# Altium schematic sheet PTFV_GECKO_SNSR.SchDoc: PTFV_GECKO_SNSR
size A4; DrawnBy: Devang Boradhara; Revision: 1; SheetNumber: 5; SheetTotal: 5  of  5
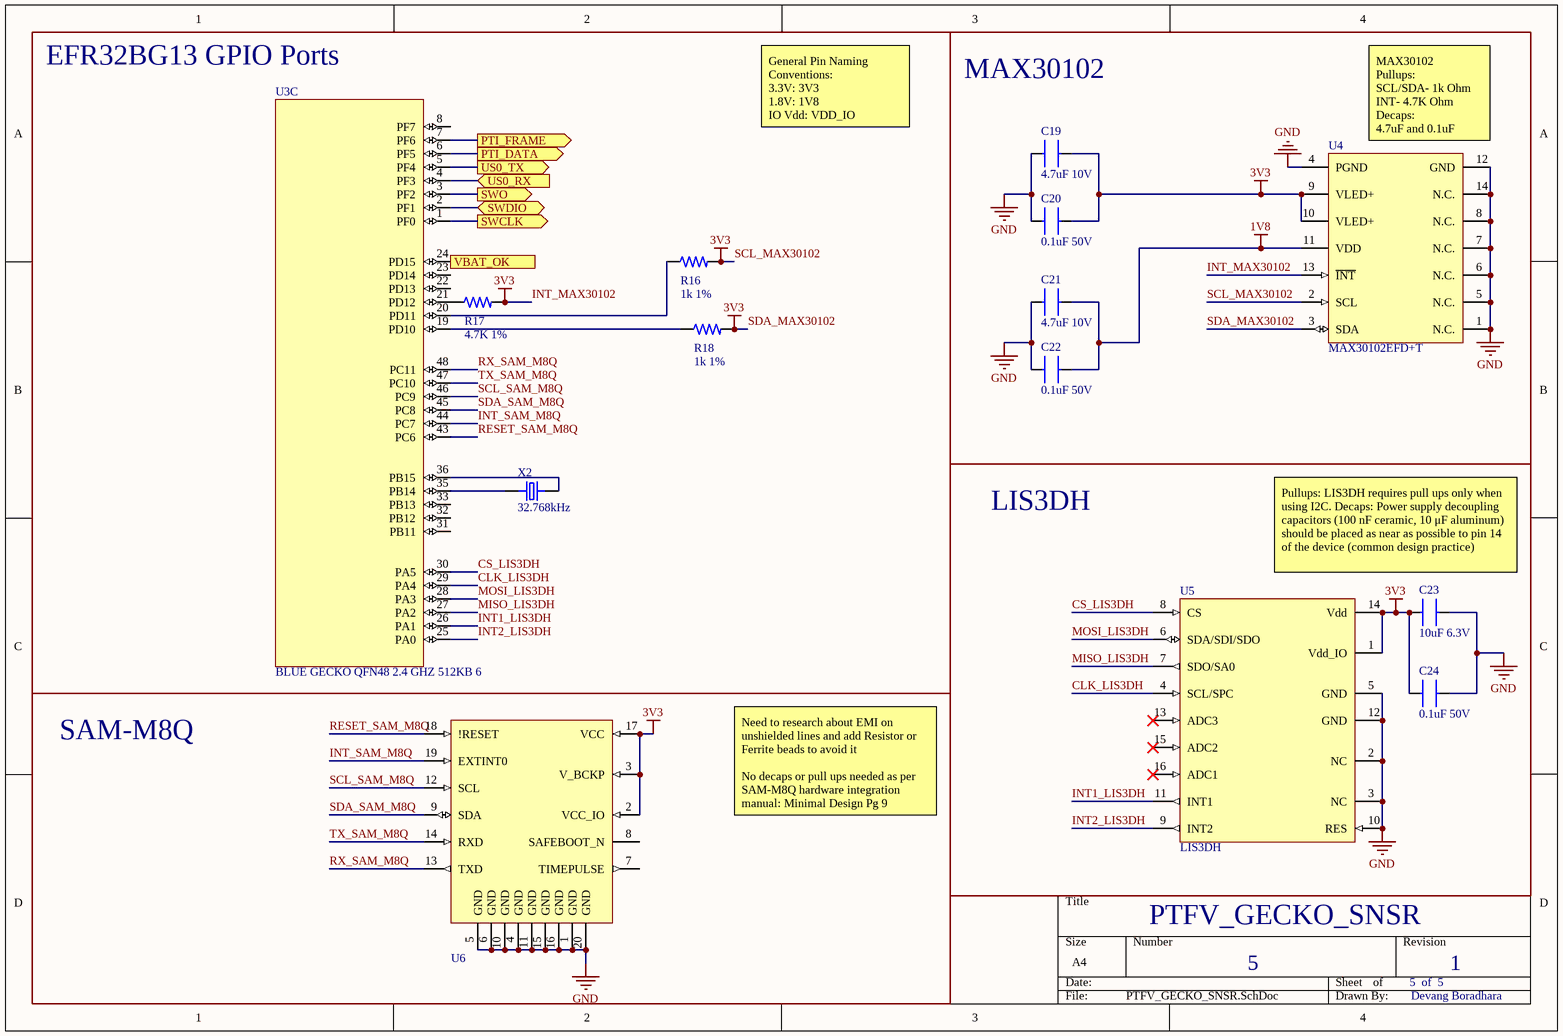
[diagram p0: PTFV_GECKO_SNSR.SchDoc]

## Parts
C19  4.7uF 10V  [CAP_0603_1MM]
C20  0.1uF 50V  [CAP_0603_1MM]
C21  4.7uF 10V  [CAP_0603_1MM]
C22  0.1uF 50V  [CAP_0603_1MM]
C23  10uF 6.3V  [CAP_0603_1MM]
C24  0.1uF 50V  [CAP_0603_1MM]
R16  1k 1%  [RES_0603_1608X06]
R17  4.7K 1%  [RES_0603_1608X06]
R18  1k 1%  [RES_0603_1608X06]
U3  BLUE GECKO QFN48 2.4 GHZ 512KB 6  [QFN_48_7X7]  (part C of 3)
U4  MAX30102EFD+T  [14_SON_SPO2]
U5  LIS3DH  [16_QFN_LIS3DH]
U6  GPS_SAM-M8Q  [20_QFN_SAM_M8Q]  (value not drawn)
X2  32.768kHz  [XTAL_ECS-.327-7-34B-TR]

## Blocks framed on the sheet
EFR32BG13 GPIO Ports: R16-R18 U3 X2
MAX30102: C19-C22 U4
LIS3DH: C23 C24 U5
SAM-M8Q: U6

## Ports
PTI_DATA (out, see PTFV_MECHANICAL[4A]), PTI_FRAME (out, see PTFV_MECHANICAL[3A]), SWCLK (out, see PTFV_MECHANICAL[4A]), SWDIO (bidir, see PTFV_MECHANICAL[3A]), SWO (out, see PTFV_MECHANICAL[4A]), US0_RX (in, see PTFV_MECHANICAL[4A]), US0_TX (out, see PTFV_MECHANICAL[3A]), VBAT_OK (in, see PTFV_PWR_PMIC[2C])

## Nets
1V8: C21.1 C22.1 U4.11(VDD)
GND: C19.2 C20.2 C21.2 C22.2 C23.1 C24.1 U4.1(N.C.) U4.4(PGND) U4.5(N.C.) U4.6(N.C.) U4.7(N.C.) U4.8(N.C.) U4.12(GND) U4.14(N.C.) U5.2(NC) U5.3(NC) U5.5(GND) U5.10(RES) U5.12(GND) U6.1(GND) U6.4(GND) U6.5(GND) U6.6(GND) U6.10(GND) U6.11(GND) U6.15(GND) U6.16(GND) U6.20(GND)
INT_MAX30102: C19.1 C20.1 C23.2 C24.2 R16.2 R17.2 R18.2 U4.2(SCL) U4.3(SDA) U4.9(VLED+) U4.10(VLED+) U4.13(~{INT}) U5.1(Vdd_IO) U5.14(Vdd) U6.2(VCC_IO) U6.3(V_BCKP) U6.17(VCC)  [also labelled 3V3, SCL_MAX30102, SDA_MAX30102]
CLK_LIS3DH: U3.29(PA4) U5.4(SCL/SPC)
CS_LIS3DH: U3.30(PA5) U5.8(CS)
INT1_LIS3DH: U3.26(PA1) U5.11(INT1)
INT2_LIS3DH: U3.25(PA0) U5.9(INT2)
INT_SAM_M8Q: U3.44(PC7) U6.19(EXTINT0)
MISO_LIS3DH: U3.27(PA2) U5.7(SDO/SA0)
MOSI_LIS3DH: U3.28(PA3) U5.6(SDA/SDI/SDO)
PTI_DATA: U3.6(PF5) ; port PTI_DATA
PTI_FRAME: U3.7(PF6) ; port PTI_FRAME
RESET_SAM_M8Q: U3.43(PC6) U6.18(!RESET)
RX_SAM_M8Q: U3.48(PC11) U6.13(TXD)
SCL_SAM_M8Q: U3.46(PC9) U6.12(SCL)
SDA_SAM_M8Q: U3.45(PC8) U6.9(SDA)
SWCLK: U3.1(PF0) ; port SWCLK
SWDIO: U3.2(PF1) ; port SWDIO
SWO: U3.3(PF2) ; port SWO
TX_SAM_M8Q: U3.47(PC10) U6.14(RXD)
US0_RX: U3.4(PF3) ; port US0_RX
US0_TX: U3.5(PF4) ; port US0_TX
VBAT_OK: U3.24(PD15) ; port VBAT_OK
NetR16_1: R16.1 U3.20(PD11)
NetR17_1: R17.1 U3.21(PD12)
NetR18_1: R18.1 U3.19(PD10)
NetU3_35: U3.35(PB14) X2.1
NetU3_36: U3.36(PB15) X2.2

Not connected (* = marked no-connect by the designer): U3 8(PF7) 22(PD13) 23(PD14) 31(PB11) 32(PB12) 33(PB13); U5 13(ADC3)* 15(ADC2)* 16(ADC1)*; U6 7(TIMEPULSE) 8(SAFEBOOT_N)

## Notes on the sheet
- General Pin Naming Conventions:
  3.3V: 3V3
  1.8V: 1V8
  IO Vdd: VDD_IO
- (near U4) MAX30102
  Pullups:
  SCL/SDA- 1k Ohm
  INT- 4.7K Ohm
  Decaps:
  4.7uF and 0.1uF
- Pullups: LIS3DH requires pull ups only when using I2C. Decaps: Power supply decoupling capacitors (100 nF ceramic, 10 μF aluminum) should be placed as near as possible to pin 14 of the device (common design practice)
- Need to research about EMI on unshielded lines and add Resistor or Ferrite beads to avoid it
  No decaps or pull ups needed as per  SAM-M8Q hardware integration manual: Minimal Design Pg 9

## Library data of the parts
C19 C21 = CL10A475KP8NNNC: CAP CER 4.7UF 10V X5R 0603; Manufacturer: Samsung; Material: 4241ConductorMaterial; Tolerance: 10%; Supplier: Digi-Key; Supplier Part Number: 1276-1044-1-ND; Manufacturer Part Number: CL10A475KP8NNNC; RoHS: Yes; Category: Ceramic Capacitors; Stock: 4678169; Pricing: 1=0.1, 10=0.043, 50=0.0234, 100=0.0192, 500=0.01368, 1000=0.01075 (USD); Mounting Technology: Surface Mount; Case/Package: 0603; Case Code (Metric): 1608; Case Code (Imperial): 0603; Min Operating Temperature: -55°C; Max Operating Temperature: 85°C; Package Quantity: 1; Packaging: Tape and Reel; Value: 4.7uF; Voltage Rating: 10V; Dielectric: X5R; Series: CL; Construction: Flat; Voltage Rating (DC): 10V; Length: 1.6mm; Width: 0.031inch; Height: 0.8mm; Thickness: 0.035inch; Depth: 0.8mm; Radiation Hardening: No; RoHS Compliant: Yes; ComponentLink1URL: https://datasheet.ciiva.com/25797/cl10a475kp8nnnc-25797520.pdf?src-supplier=Digi-Key; ComponentLink1Description: https://datasheet.ciiva.com/25797/cl10a475kp8nnnc-25797520.pdf?src-supplier=Digi-Key; ComponentLink2URL: https://datasheet.ciiva.com/26838/getdatasheetpartid-358676-26838384.pdf?src-supplier=Verical; ComponentLink2Description: https://datasheet.ciiva.com/26838/getdatasheetpartid-358676-26838384.pdf?src-supplier=Verical; ComponentLink3URL: https://datasheet.ciiva.com/16318/cl05b104kq5nnnc-16318245.pdf?src-supplier=Future+Electronics; ComponentLink3Description: https://datasheet.ciiva.com/16318/cl05b104kq5nnnc-16318245.pdf?src-supplier=Future+Electronics
C20 C22 C24 = CC0603KRX5R9BB104: CAP CER 0.1UF 50V X5R 0603; Manufacturer: Yageo; Value: 100nF; Tolerance: 10%; Supplier: Digi-Key; Supplier Part Number: 311-4046-1-ND; Manufacturer Part Number: CC0603KRX5R9BB104; RoHS: Yes; Category: Ceramic Capacitors; Stock: 45165; Pricing: 1=0.1, 10=0.052, 50=0.0282, 100=0.0231, 500=0.01648, 1000=0.01294 (USD); Mounting Technology: Surface Mount; Case/Package: 0603; Case Code (Imperial): 0603; Case Code (Metric): 1608; Weight: 7.1E-05oz; Min Operating Temperature: -55°C; Max Operating Temperature: 85°C; Packaging: Tape and Reel; Voltage Rating: 50V; Dielectric: X5R; Termination: SMD/SMT; Voltage Rating (DC): 50V; Package Quantity: 4000; Series: CC; Length: 0.063inch; Width: 0.031inch; Thickness: 0.035inch; Lead Free: Lead Free; Halogen Free: Halogen Free; ComponentLink1URL: http://www.mouser.com/ds/2/447/Yageo_UPY-GP_NP0_16V-to-50V_9-358835.pdf?src-supplier=Mouser; ComponentLink1Description: http://www.mouser.com/ds/2/447/Yageo_UPY-GP_NP0_16V-to-50V_9-358835.pdf?src-supplier=Mouser; ComponentLink2URL: http://www.yageo.com/exep/pages/download/literatures/ProductSelectionGuide%202014_Final_2.pdf?src-supplier=Digi-Key; ComponentLink2Description: http://www.yageo.com/exep/pages/download/literatures/ProductSelectionGuide%202014_Final_2.pdf?src-supplier=Digi-Key; ComponentLink3URL: https://datasheet.octopart.com/CC0603KRX5R9BB104-Yageo-datasheet-158238148.pdf?src-supplier=Newark; ComponentLink3Description: https://datasheet.octopart.com/CC0603KRX5R9BB104-Yageo-datasheet-158238148.pdf?src-supplier=Newark; ComponentLink4URL: https://www.yageo.com/upload/media/product/productsearch/datasheet/mlcc/UPY-GPHC_X5R_4V-to-50V_26.pdf?src-supplier=Digi-Key; ComponentLink4Description: https://www.yageo.com/upload/media/product/productsearch/datasheet/mlcc/UPY-GPHC_X5R_4V-to-50V_26.pdf?src-supplier=Digi-Key; ComponentLink5URL: https://datasheet.octopart.com/CC0603KRX5R9BB104-Yageo-datasheet-137875056.pdf?src-supplier=Future+Electronics; ComponentLink5Description: https://datasheet.octopart.com/CC0603KRX5R9BB104-Yageo-datasheet-137875056.pdf?src-supplier=Future+Electronics
C23 = CL10A106MQ8NNNC: CAP CER 10UF 6.3V X5R 0603; Manufacturer: Samsung; Tolerance: 20%; Supplier: Digi-Key; Supplier Part Number: 1276-1119-1-ND; Manufacturer Part Number: CL10A106MQ8NNNC; RoHS: Yes; Category: Ceramic Capacitors; Stock: 2041935; Pricing: 1=0.11, 10=0.083, 50=0.0452, 100=0.0369, 500=0.02638, 1000=0.02072 (USD); Mounting Technology: Surface Mount; Case/Package: 0603; Case Code (Metric): 1608; Case Code (Imperial): 0603; Min Operating Temperature: -55°C; Max Operating Temperature: 85°C; Packaging: Tape and Reel; Value: 10uF; Voltage Rating: 6.3V; Dielectric: X5R; Voltage: 6.3V; Series: CL; Construction: Flat; Length: 1.6mm; Height: 0.8mm; Depth: 0.8mm; Radiation Hardening: No; RoHS Compliant: Yes; ComponentLink1URL: https://datasheet.ciiva.com/25798/cl10a106mq8nnnc-25798320.pdf?src-supplier=Digi-Key; ComponentLink1Description: https://datasheet.ciiva.com/25798/cl10a106mq8nnnc-25798320.pdf?src-supplier=Digi-Key; ComponentLink2URL: https://datasheet.ciiva.com/26838/getdatasheetpartid-357557-26838347.pdf?src-supplier=Verical; ComponentLink2Description: https://datasheet.ciiva.com/26838/getdatasheetpartid-357557-26838347.pdf?src-supplier=Verical; ComponentLink3URL: https://datasheet.ciiva.com/16437/cl05b104kq5nnnc-16437327.pdf?src-supplier=Future+Electronics; ComponentLink3Description: https://datasheet.ciiva.com/16437/cl05b104kq5nnnc-16437327.pdf?src-supplier=Future+Electronics
R16 R18 = RC0603FR-071KL: RES SMD 1k OHM 1% 1/10W 0603; Manufacturer: Yageo; Power Rating: 100mW; Value: 1kR; Voltage Rating: 50V; Temperature Coefficient: 100ppm/°C; Supplier: Digi-Key; Supplier Part Number: 311-1.00KHRCT-ND; Manufacturer Part Number: RC0603FR-071KL; RoHS: Yes; Category: Chip SMD Resistors; Stock: 18911788; Pricing: 1=0.1, 10=0.018, 50=0.0106, 100=0.0088, 500=0.00592, 1000=0.00505 (USD); Case/Package: 0603; Case Code (Imperial): 0603; Case Code (Metric): 1608; Contact Plating: Tin,Matte; Min Operating Temperature: -55°C; Max Operating Temperature: 155°C; Tolerance: 1%; Packaging: Tape and Reel; Termination: SMD/SMT; Resistor Type: Thick Film; Features: Moisture Resistant; Series: RC; Max Power Dissipation: 100mW; Number of Terminations: 2; Resistance Tolerance: 1%; Construction: Rectangular; Technology: THICK FILM; Length: 1.6mm; Height: 0.45mm; Depth: 0.8mm; Reach SVHC Compliant: No; Military Standard: Not; RoHS Compliant: Yes; Lead Free: 5697LeadFree
R17 = RMCF0603FT4K70: RES SMD 4.7K OHM 1% 1/10W 0603; Manufacturer: Stackpole Electronics; Value: 4.7kR; Max Power Dissipation: 100mW; Temperature Coefficient: 100ppm/°C; Supplier: Digi-Key; Supplier Part Number: RMCF0603FT4K70CT-ND; Manufacturer Part Number: RMCF0603FT4K70; RoHS: Yes; Category: Chip SMD Resistors; Stock: 560754; Pricing: 1=0.1, 10=0.014, 50=0.0086, 100=0.0071, 500=0.00474, 1000=0.00404 (USD); Mounting Technology: Surface Mount; Case/Package: 0603; Case Code (Metric): 1608; Case Code (Imperial): 0603; Contact Plating: Tin,Matte; Min Operating Temperature: -55°C; Max Operating Temperature: 155°C; Packaging: Tape and Reel; Tolerance: 1%; Number of Terminations: 2; Features: Automotive AEC-Q200; Series: RMCF; Construction: Rectangular; Length: 0.061inch; Width: 0.031inch; Height: 0.022inch; Depth: 0.8mm; Radiation Hardening: No; Military Standard: Not; Lead Free: Lead Free; RoHS Compliant: Yes; ComponentLink1URL: https://datasheet.ciiva.com/26835/getdatasheetpartid-486078-26835642.pdf?src-supplier=Verical; ComponentLink1Description: https://datasheet.ciiva.com/26835/getdatasheetpartid-486078-26835642.pdf?src-supplier=Verical
U3 = EFR32BG13P632F512GM48-DR: Blue Gecko BLE Soc QFN48 2.4 G 10 dB BLE/Proprietary 512 kB 64 kB(RAM) 31GPIO; Manufacturer: Silicon Labs; Interface: I2C,SPI,IrDA,UART,USART; Frequency: 2.4835GHz; Data Rate: 2Mbps; Sensitivity: -103.3dBm; Memory Size: 64KB; Current - Receiving: 14mA; Current - Transmitting: 134.3mA; Number of GPIO: 16; Supplier: Digi-Key; Supplier Part Number: 336-EFR32BG13P632F512GM48-DRCT-ND; Manufacturer Part Number: EFR32BG13P632F512GM48-DR; RoHS: Yes; Category: RF Receivers, Transceivers; Stock: 17415; Pricing: 1=7.18, 10=6.577, 25=5.9792, 100=5.3813, 250=4.93284, 500=4.4844, 1000=4.03596 (USD); Mounting Technology: Surface Mount; Case/Package: QFN; Min Operating Temperature: -40°C; Max Operating Temperature: 85°C; Series: EFR32™ Blue Gecko; RoHS Compliant: Yes
U4 = MAX30102EFD+T: SENSOR OXIMETER/HEART RATE I2C; Manufacturer: Maxim; Throw Configuration: ANALOG CIRCUIT; Channels: 1; Max Supply Voltage: 2V; Min Supply Voltage: 1.7V; Nominal Supply Voltage: 1.8V; Supplier: Digi-Key; Supplier Part Number: MAX30102EFD+TDKR-ND; Manufacturer Part Number: MAX30102EFD+T; RoHS: Yes; Category: Sensors; Stock: 778; Pricing: 1=10.88, 10=10, 25=9.5856, 100=8.4455, 250=8.031, 500=7.51288, 1000=6.89113 (USD); Pins: 14; Package Shape: Rectangular; Min Operating Temperature: -40°C; Max Operating Temperature: 85°C; Package Style: GRID ARRAY, LOW PROFILE, FINE PITCHMeter; Surface Mount: Yes; Terminal Form: BUTT; Terminal Position: BOTTOM; Length: 5.6mm; Width: 3.3mm; Height - Seated (Max): 1.65mm; Terminal Pitch: 0.8mm; Reach SVHC Compliant: Yes; Temperature Grade: INDUSTRIAL; RoHS Compliant: Yes; ComponentLink1URL: https://datasheet.ciiva.com:443/pdfs/VipMasterIC/IC/MAXM/MAXM-S-A0006604198/MAXM-S-A0006604198-1.pdf?src-supplier=IHS+Markit; ComponentLink1Description: https://datasheet.ciiva.com:443/pdfs/VipMasterIC/IC/MAXM/MAXM-S-A0006604198/MAXM-S-A0006604198-1.pdf?src-supplier=IHS+Markit; ComponentLink2URL: https://datasheets.maximintegrated.com/en/ds/MAX30102.pdf?src-supplier=Digi-Key; ComponentLink2Description: https://datasheets.maximintegrated.com/en/ds/MAX30102.pdf?src-supplier=Digi-Key
U5 = LIS3DH: MEMS digital output motion sensor: / ultra-low-power high-performance 3-axis "nano" accelerometer
U6 = SAM-M8Q-0-10: RF Receiver Galileo, GLONASS, GPS 1.575GHz, 1.602GHz -165dBm 400kbps On-Board, Patch Module; Manufacturer: u-blox; Telecom IC Type: TELECOM CIRCUIT; Supplier: Digi-Key; Supplier Part Number: 672-1054-1-ND; Manufacturer Part Number: SAM-M8Q-0; RoHS: Yes; Category: RF Receivers, Transceivers; Stock: 3732; Pricing: 1=31.5, 10=25.91, 50=21.24, 100=18.1279 (USD); RoHS Compliant: Yes; ComponentLink1URL: https://datasheet.ciiva.com:443/pdfs/VipMasterIC/IC/UBLO/UBLO-S-A0004996580/UBLO-S-A0004996580-1.pdf?src-supplier=IHS+Markit; ComponentLink1Description: https://datasheet.ciiva.com:443/pdfs/VipMasterIC/IC/UBLO/UBLO-S-A0004996580/UBLO-S-A0004996580-1.pdf?src-supplier=IHS+Markit; ComponentLink2URL: https://www.u-blox.com/sites/default/files/SAM-M8Q_DataSheet_%28UBX-16012619%29.pdf?src-supplier=Digi-Key; ComponentLink2Description: https://www.u-blox.com/sites/default/files/SAM-M8Q_DataSheet_%28UBX-16012619%29.pdf?src-supplier=Digi-Key
X2 = ECS-.327-7-34B-TR: 32.768kHz Â±20ppm Crystal 7pF 70 kOhms 2-SMD, No Lead; MF: ECS Inc.; Availability: Unavailable; MP: ECS-.327-7-34B-TR; Price: None; Value: *; SnapEDA_Link: https://www.snapeda.com/parts/ECS-.327-7-34B-TR/ECS%20Inc./view-part/55054/?ref=snap; Package: SMD-2 ECS International